# Altium schematic sheet ADS7946.SchDoc
size A4
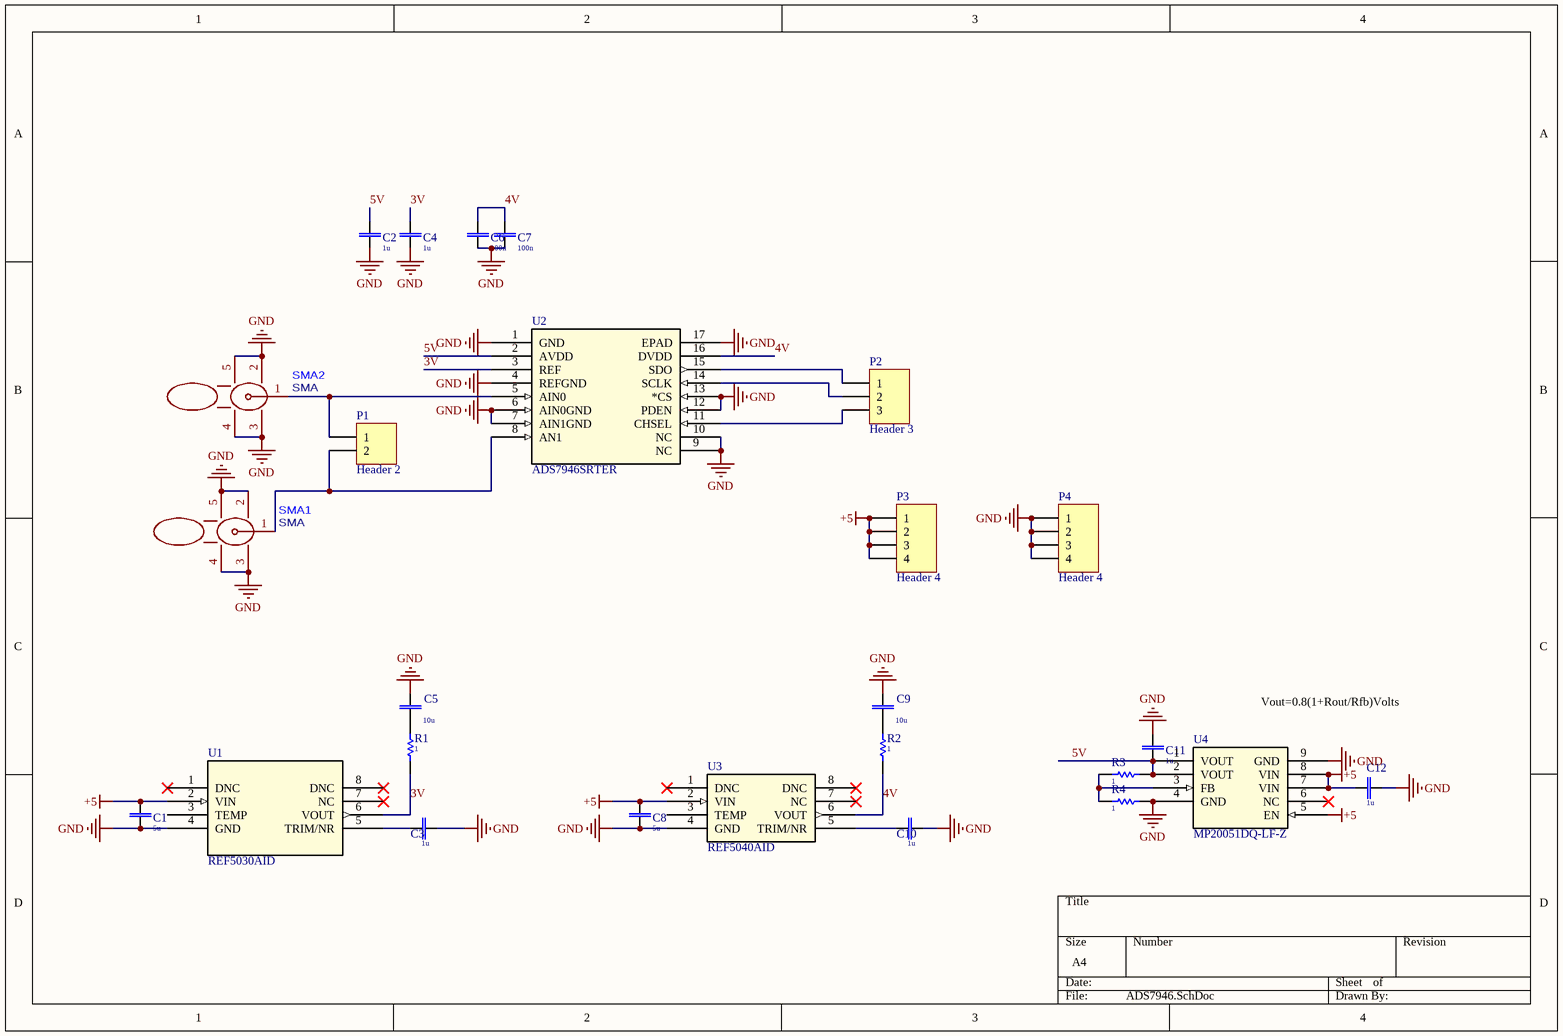
[diagram p0: ADS7946.SchDoc]

## Parts
C1  value 5u  [0603]  (hidden comment: Cap)
C2  value 1u  [0603]  (hidden comment: Cap)
C3  value 1u  [0603]  (hidden comment: Cap)
C4  value 1u  [0603]  (hidden comment: Cap)
C5  value 10u  [0603]  (hidden comment: Cap)
C6  value 100n  [0603]  (hidden comment: Cap)
C7  value 100n  [0603]  (hidden comment: Cap)
C8  value 5u  [0603]  (hidden comment: Cap)
C9  value 10u  [0603]  (hidden comment: Cap)
C10  value 1u  [0603]  (hidden comment: Cap)
C11  value 1u  [0603]  (hidden comment: Cap)
C12  value 1u  [0603]  (hidden comment: Cap)
P1  Header 2  [HDR1X2]
P2  Header 3  [HDR1X3]
P3  Header 4  [HDR1X4]
P4  Header 4  [HDR1X4]
R1  1  [RES 0805N (2012)]
R2  1  [RES 0805N (2012)]
R3  1  [RES 0805N (2012)]
R4  1  [RES 0805N (2012)]
SMA1  SMA  [SMA-SMD_BWSMA-KE-P001]
SMA2  SMA  [SMA-SMD_BWSMA-KE-P001]
U1  REF5030AID  [D8]
U2  ADS7946SRTER  [RTE16_1P7X1P7]
U3  REF5040AID  [D8]
U4  MP20051DQ-LF-Z  [QFN-8_MP20051_MNP]

## Nets
+5: C1.2 C8.2 C12.2 P3.1 P3.2 P3.3 P3.4 U1.2(VIN) U3.2(VIN) U4.5(EN) U4.7(VIN) U4.8(VIN)
GND: C1.1 C2.1 C3.2 C4.1 C5.2 C6.1 C7.1 C8.1 C9.2 C10.2 C11.1 C12.1 P4.1 P4.2 P4.3 P4.4 R4.1 SMA1.2 SMA1.3 SMA1.4 SMA1.5 SMA2.2 SMA2.3 SMA2.4 SMA2.5 U1.4(GND) U2.1(GND) U2.4(REFGND) U2.6(AIN0GND) U2.7(AIN1GND) U2.9(NC) U2.10(NC) U2.12(PDEN) U2.13(*CS) U2.17(EPAD) U3.4(GND) U4.4(GND) U4.9(GND)
3V: C4.2 R1.1 U1.6(VOUT) U2.3(REF)
4V: C6.2 C7.2 R2.1 U2.16(DVDD) U3.6(VOUT)
5V: C2.2 C11.2 R3.1 U2.2(AVDD) U4.1(VOUT) U4.2(VOUT)
NetC3_1: C3.1 U1.5(TRIM/NR)
NetC5_1: C5.1 R1.2
NetC9_1: C9.1 R2.2
NetC10_1: C10.1 U3.5(TRIM/NR)
NetP1_1: P1.1 SMA2.1 U2.5(AIN0)
NetP1_2: P1.2 SMA1.1 U2.8(AN1)
NetP2_1: P2.1 U2.15(SDO)
NetP2_2: P2.2 U2.14(SCLK)
NetP2_3: P2.3 U2.11(CHSEL)
NetR3_2: R3.2 R4.2 U4.3(FB)

Not connected (* = marked no-connect by the designer): U1 1(DNC)* 3(TEMP) 7(NC)* 8(DNC)*; U3 1(DNC)* 3(TEMP) 7(NC)* 8(DNC)*; U4 6(NC)*

## Notes on the sheet
- (near U4) Vout=0.8(1+Rout/Rfb)Volts

## Library data of the parts
C1-C12 = Cap: Capacitor; Published: 8-Jun-2000; LatestRevisionDate: 17-Jul-2002; LatestRevisionNote: Re-released for DXP Platform.; PackageReference: RAD-0.3; Publisher: Altium Limited
P1 = Header 2: Header, 2-Pin; LatestRevisionDate: 17-Jul-2002; LatestRevisionNote: Re-released for DXP Platform.; Publisher: Altium Limited
P2 = Header 3: Header, 3-Pin; LatestRevisionDate: 17-Jul-2002; LatestRevisionNote: Re-released for DXP Platform.; Publisher: Altium Limited
P3 P4 = Header 4: Header, 4-Pin; LatestRevisionDate: 17-Jul-2002; LatestRevisionNote: Re-released for DXP Platform.; Publisher: Altium Limited
R1-R4 = Res1: Resistor; Published: 8-Jun-2000; LatestRevisionDate: 17-Jul-2002; LatestRevisionNote: Re-released for DXP Platform.; PackageReference: AXIAL-0.3; Publisher: Altium Limited; Value: 1
U1 = REF5030AID: No Description Available; Mfr_Name: Texas Instruments; Copyright: Copyright (C) 2022 Ultra Librarian. All rights reserved.; Manufacturer_Part_Number: REF5030AID; RefDes: RefDes; Type: DEV
U2 = ADS7946SRTER: No Description Available; Mfr_Name: Texas Instruments; Copyright: Copyright (C) 2022 Ultra Librarian. All rights reserved.; Manufacturer_Part_Number: ADS7946SRTER; RefDes: RefDes; Type: DEV
U3 = REF5040AID: No Description Available; Mfr_Name: Texas Instruments; Copyright: Copyright (C) 2022 Ultra Librarian. All rights reserved.; Manufacturer_Part_Number: REF5040AID; RefDes: RefDes; Type: DEV
U4 = MP20051DQ-LF-Z: No Description Available; Mfr_Name: Monolithic Power Systems; Copyright: Copyright (C) 2022 Ultra Librarian. All rights reserved.; Manufacturer_Part_Number: MP20051DQ-LF-Z; RefDes: RefDes; Type: DEV